# EAGLE schematic JSR registers (EAGLE 9.6.2)
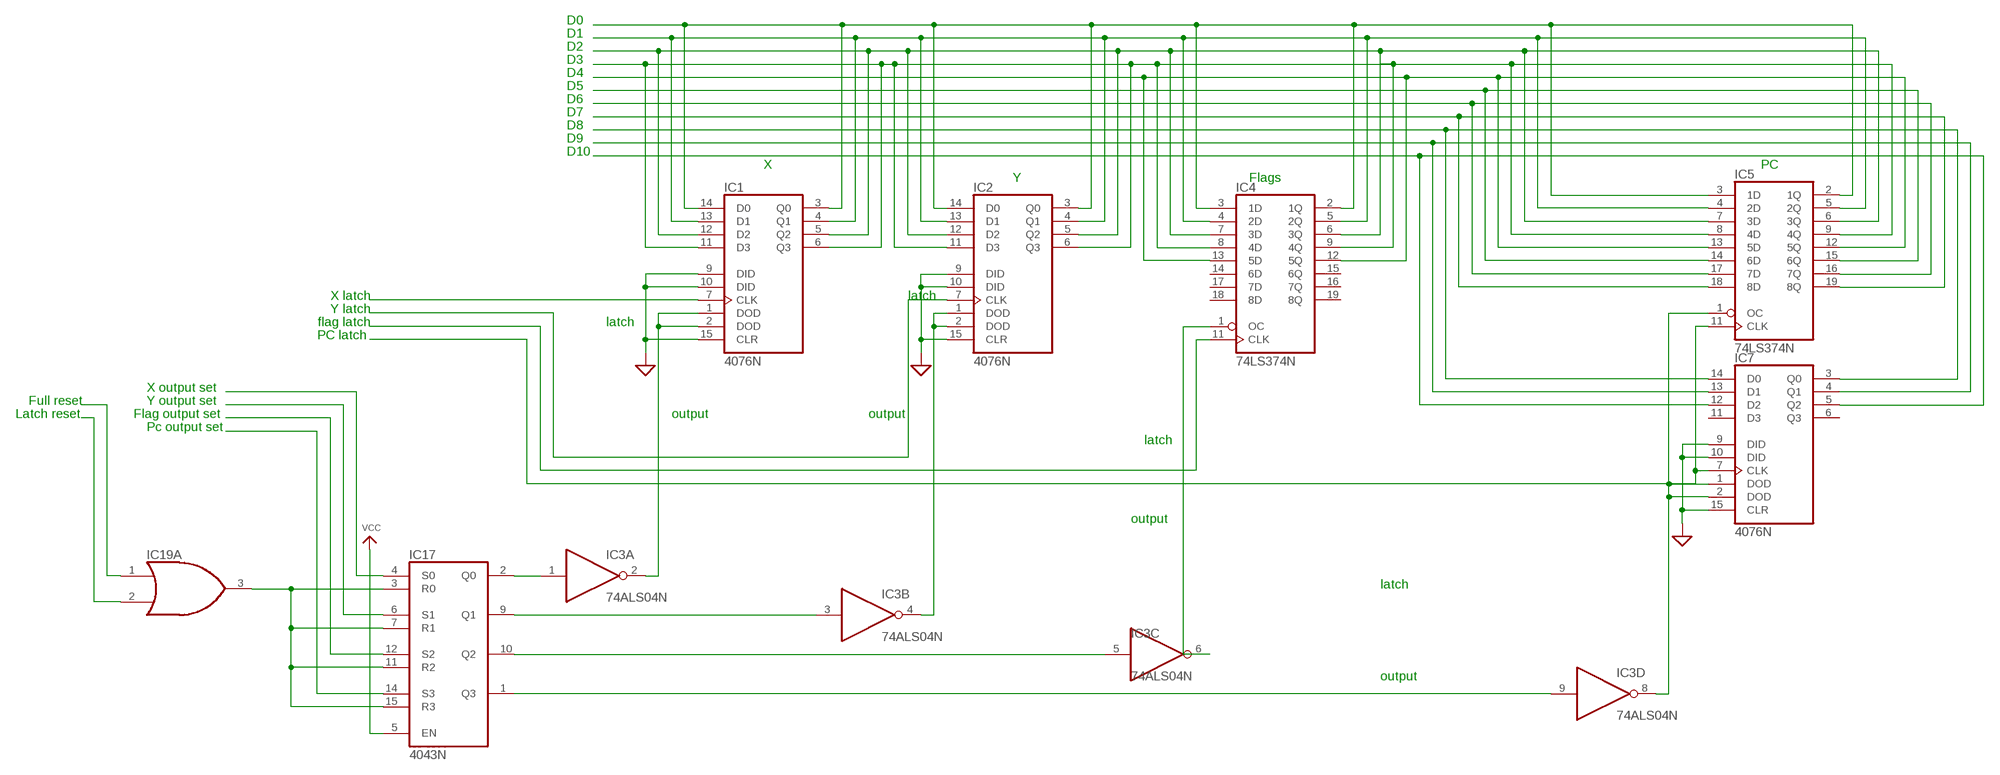
[diagram p0: schematic, sheet 1]

## Parts
IC1  4076N  [DIL16]
IC2  4076N  [DIL16]
IC3  74ALS04N  [DIL14]
IC4  74LS374N  [DIL20]
IC5  74LS374N  [DIL20]
IC7  4076N  [DIL16]
IC17  4043N  [DIL16]
IC19  74LS32N  [DIL14]

## Nets
GND: IC1.9(DID) IC1.10(DID) IC1.15(CLR) IC2.9(DID) IC2.10(DID) IC2.15(CLR) IC7.9(DID) IC7.10(DID) IC7.15(CLR) ; supply symbol labelled SUP
N$1: IC1.1(DOD) IC1.2(DOD) IC3.2(A:O)
N$2: IC2.1(DOD) IC2.2(DOD) IC3.4(B:O)
N$3: IC3.6(C:O) IC4.1(OC)
N$4: IC5.11(CLK) IC7.7(CLK)
N$5: IC3.8(D:O) IC5.1(OC) IC7.1(DOD) IC7.2(DOD)
N$6: IC1.3(Q0) IC1.14(D0) IC2.3(Q0) IC2.14(D0) IC4.2(1Q) IC4.3(1D) IC5.2(1Q) IC5.3(1D)
N$7: IC1.4(Q1) IC1.13(D1) IC2.4(Q1) IC2.13(D1) IC4.4(2D) IC4.5(2Q) IC5.4(2D) IC5.5(2Q)
N$9: IC1.6(Q3) IC1.11(D3) IC2.6(Q3) IC2.11(D3) IC4.8(4D) IC4.9(4Q) IC5.8(4D) IC5.9(4Q)
N$10: IC4.12(5Q) IC4.13(5D) IC5.12(5Q) IC5.13(5D)
N$11: IC5.14(6D) IC5.15(6Q)
N$12: IC5.16(7Q) IC5.17(7D)
N$13: IC5.18(8D) IC5.19(8Q)
N$14: IC7.3(Q0) IC7.14(D0)
N$15: IC7.4(Q1) IC7.13(D1)
N$16: IC7.5(Q2) IC7.12(D2)
N$17: IC19.2(A:I1)
N$18: IC1.5(Q2) IC1.12(D2) IC2.5(Q2) IC2.12(D2) IC4.6(3Q) IC4.7(3D) IC5.6(3Q) IC5.7(3D)
N$23: IC4.11(CLK)
N$41: IC3.9(D:I) IC17.1(Q3)
N$43: IC17.3(R0) IC17.7(R1) IC17.11(R2) IC17.15(R3) IC19.3(A:O)
N$47: IC17.14(S3)
N$48: IC19.1(A:I0)
N$49: IC3.5(C:I) IC17.10(Q2)
N$50: IC1.7(CLK)
N$51: IC2.7(CLK)
N$52: IC17.12(S2)
N$55: IC3.1(A:I) IC17.2(Q0)
N$56: IC17.4(S0)
N$57: IC3.3(B:I) IC17.9(Q1)
N$58: IC17.6(S1)
VCC: IC17.5(EN)
Unconnected: IC3.10(E:O) IC3.11(E:I) IC3.12(F:O) IC3.13(F:I) IC4.14(6D) IC4.15(6Q) IC4.16(7Q) IC4.17(7D) IC4.18(8D) IC4.19(8Q) IC7.6(Q3) IC7.11(D3) IC19.4(B:I0) IC19.5(B:I1) IC19.6(B:O) IC19.8(C:O) IC19.9(C:I0) IC19.10(C:I1) IC19.11(D:O) IC19.12(D:I0) IC19.13(D:I1)

## Notes on the sheet
- D0
- D1
- D2
- D3
- D4
- D5
- D6
- D7
- D8
- D9
- D10
- X | PC
- Y | Flags
- X latch | latch
- Y latch
- flag latch | latch
- PC latch
- X output set
- Full reset | Y output set
- Latch reset | Flag output set | output | output
- Pc output set
- latch
- output
- latch
- output

## Power pins joined to a net without a drawn wire
GND: IC3.7(P:GND) IC4.10(GND) IC5.10(GND) IC19.7(P:GND)
VCC: IC3.14(P:VCC) IC4.20(VCC) IC5.20(VCC) IC19.14(P:VCC)
VDD: IC1.16(VDD) IC2.16(VDD) IC7.16(VDD) IC17.16(VDD)
VSS: IC1.8(VSS) IC2.8(VSS) IC7.8(VSS) IC17.8(VSS)

## Library data of the parts
IC1 IC2 IC7 = 40xx:4076: Quad D-type REGISTER
IC3 = 74xx-us:74*04: Hex INVERTER
IC4 IC5 = 74xx-us:74*374: Octal D type transparent LATCH, edge triggered
IC17 = 40xx:4043: Quad 3-state NOR R/S LATCH
IC19 = 74xx-us:74*32: Quad 2-input OR gate